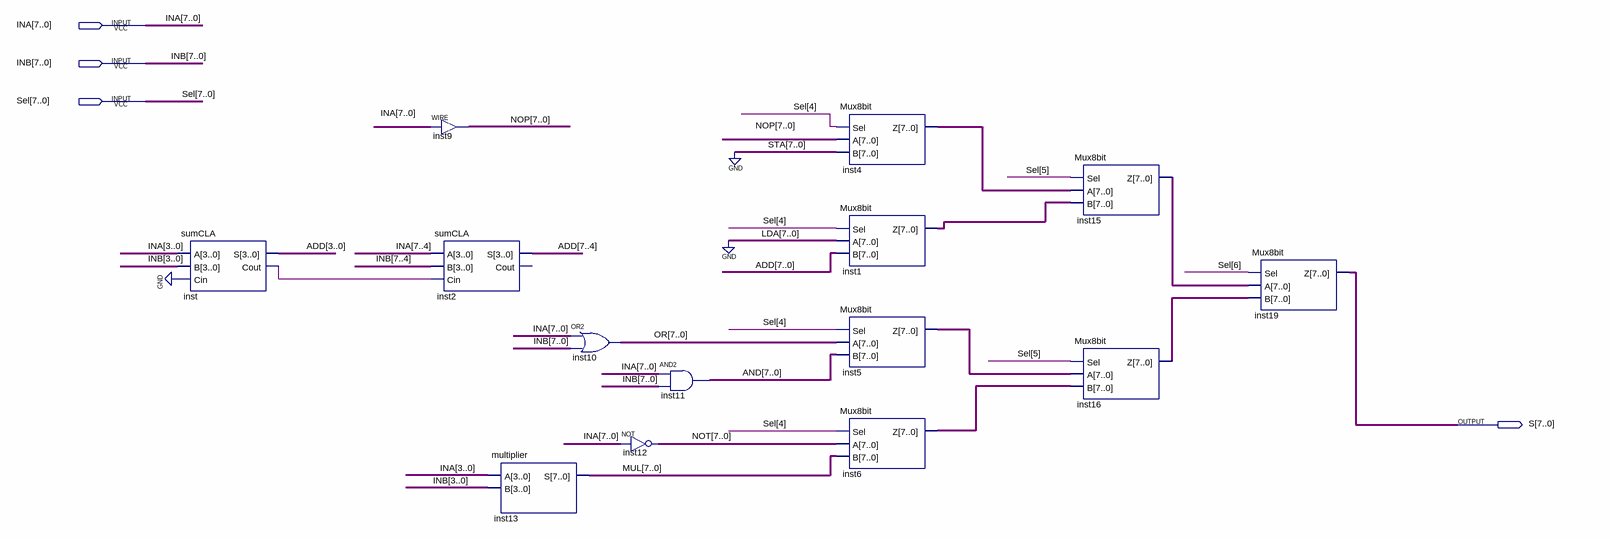
[diagram p0: schematic sheet]
// Quartus schematic ULA.bdf as structural Verilog: 14 symbols, 4 pins
module ULA (
  input  [7:0] INA,
  input  [7:0] INB,
  input  [7:0] Sel,
  output [7:0] S
);

  wire inst_cout;
  wire [7:0] ADD, AND, inst1_z, inst4_z, inst5_z, inst6_z, inst15_z, inst16_z, MUL, NOP, NOT, OR;

  sumCLA inst (.A(INA[3:0]), .B(INB[3:0]), .Cin(1'b0), .S(ADD[3:0]), .Cout(inst_cout));
  assign NOP = INA;  // WIRE inst9
  sumCLA inst2 (.A(INA[7:4]), .B(INB[7:4]), .Cin(inst_cout), .S(ADD[7:4]));  // open: Cout
  multiplier inst13 (.A(INA[3:0]), .B(INB[3:0]), .S(MUL));
  assign OR = INA | INB;  // OR2 inst10, 8 bits wide
  assign NOT = ~INA;  // NOT inst12, 8 bits wide
  assign AND = INA & INB;  // AND2 inst11, 8 bits wide
  Mux8bit inst4 (.Sel(Sel[4]), .A(NOP), .B({8{1'b0}}), .Z(inst4_z));
  Mux8bit inst1 (.Sel(Sel[4]), .A({8{1'b0}}), .B(ADD), .Z(inst1_z));
  Mux8bit inst5 (.Sel(Sel[4]), .A(OR), .B(AND), .Z(inst5_z));
  Mux8bit inst6 (.Sel(Sel[4]), .A(NOT), .B(MUL), .Z(inst6_z));
  Mux8bit inst15 (.Sel(Sel[5]), .A(inst4_z), .B(inst1_z), .Z(inst15_z));
  Mux8bit inst16 (.Sel(Sel[5]), .A(inst5_z), .B(inst6_z), .Z(inst16_z));
  Mux8bit inst19 (.Sel(Sel[6]), .A(inst15_z), .B(inst16_z), .Z(S));
endmodule
